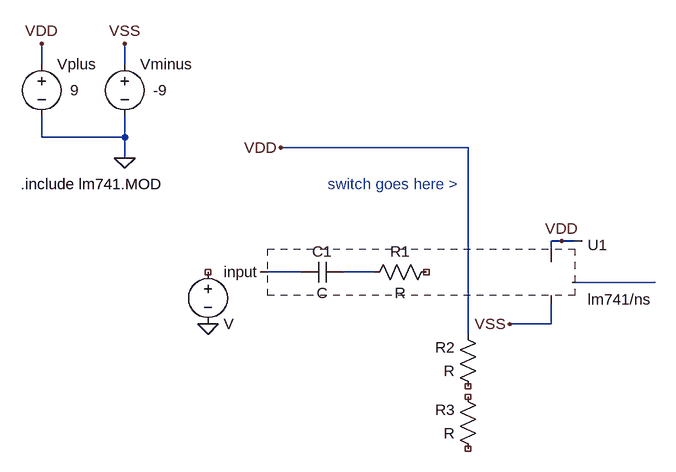
[diagram p0: schematic E1201 741 useage copy.asc]
E1201 741 useage copy.asc, the LTspice schematic file:
Version 4
SHEET 1 3028 728
WIRE 576 64 576 32
WIRE 704 64 704 32
WIRE 576 176 576 144
WIRE 704 176 704 144
WIRE 704 176 576 176
WIRE 1232 192 944 192
WIRE 704 208 704 176
WIRE 1376 336 1360 336
WIRE 1408 336 1376 336
WIRE 1360 368 1360 336
WIRE 976 384 912 384
WIRE 1088 384 1040 384
WIRE 1520 400 1392 400
WIRE 1360 464 1360 432
WIRE 1360 464 1296 464
WIRE 1232 480 1232 192
FLAG 704 208 0
FLAG 576 32 VDD
FLAG 704 32 VSS
FLAG 1376 336 VDD
FLAG 1296 464 VSS
FLAG 944 192 VDD
FLAG 832 464 0
SYMBOL voltage 576 48 R0
WINDOW 123 0 0 Left 2
WINDOW 39 0 0 Left 2
WINDOW 3 44 56 Left 2
SYMATTR Value 9
SYMATTR InstName Vplus
SYMBOL voltage 704 48 R0
WINDOW 123 0 0 Left 2
WINDOW 39 0 0 Left 2
WINDOW 3 44 56 Left 2
SYMATTR Value -9
SYMATTR InstName Vminus
SYMBOL opamp2 1360 336 R0
SYMATTR InstName U1
SYMATTR Value lm741/ns
SYMBOL Res 1184 368 R90
WINDOW 0 0 56 VBottom 2
WINDOW 3 32 56 VTop 2
SYMATTR InstName R1
SYMBOL Res 1248 576 R180
WINDOW 0 36 76 Left 2
WINDOW 3 36 40 Left 2
SYMATTR InstName R2
SYMBOL Res 1248 672 R180
WINDOW 0 36 76 Left 2
WINDOW 3 36 40 Left 2
SYMATTR InstName R3
SYMBOL Cap 1040 368 R90
WINDOW 0 0 32 VBottom 2
WINDOW 3 32 32 VTop 2
SYMATTR InstName C1
SYMBOL Voltage 832 368 R0
SYMATTR InstName input
TEXT 544 248 Left 2 !.include lm741.MOD
TEXT 1016 248 Left 2 ;switch goes here >

The netlist it stands for:
* E1201 741 useage copy.asc
Vplus VDD 0 9
Vminus VSS 0 -9
* U1: lm741/ns (symbol opamp2 not available, pin order unknown); nets seen at it: N001, N003, VDD, VSS
R1 NC_01 N002 R
R2 NC_02 VDD R
R3 NC_03 NC_04 R
C1 N002 N001 C
V§input NC_05 0 V
.include lm741.MOD
* switch goes here >
.backanno
.end